# EAGLE schematic remote_2313_4313 (EAGLE 7.6.0)
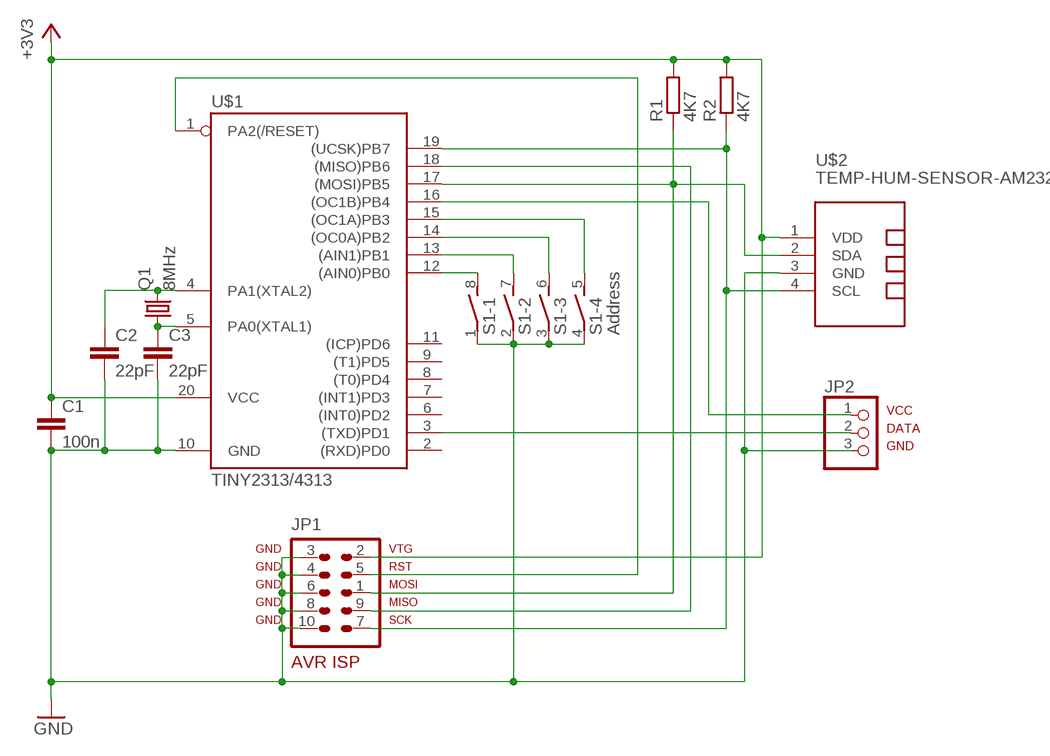
[diagram p0: schematic, sheet 1]

## Parts
C1  100n  C-EU025-025X050  [C025-025X050]
C2  22pF  C-EU025-024X044  [C025-024X044]
C3  22pF  C-EU025-024X044  [C025-024X044]
JP1  AVR-ISP-10  [AVR-ISP-10]
JP2  PINHD-1X3  [1X03]
Q1  8MHz  CRYSTALHC49U-V  [HC49U-V]
R1  4K7  R-EU_0204/5  [0204/5]
R2  4K7  R-EU_0204/5  [0204/5]
S1  Address  DIP04S  [DIP04S]
U$1  TINY2313/4313  TINY2313-*P*  [DIL20]
U$2  TEMP-HUM-SENSOR-AM2322  [TEMP-HUM-SENSOR-AM2322]

## Nets
+3V3: C1.1 JP1.2 R1.2 R2.2 U$1.20(VCC) U$2.1(VDD)
GND: C1.2 C2.2 C3.2 JP1.3 JP1.4 JP1.6 JP1.8 JP1.10 JP2.3 S1.1 S1.2 S1.3 S1.4 U$1.10(GND) U$2.3(GND)
N$1: S1.8 U$1.12((AIN0)PB0)
N$2: S1.7 U$1.13((AIN1)PB1)
N$3: S1.6 U$1.14((OC0A)PB2)
N$4: S1.5 U$1.15((OC1A)PB3)
N$5: JP2.1 U$1.16((OC1B)PB4)
N$6: JP1.1 R1.1 U$1.17((MOSI)PB5) U$2.2(SDA)
N$7: JP2.2 U$1.3((TXD)PD1)
N$8: JP1.7 R2.1 U$1.19((UCSK)PB7) U$2.4(SCL)
N$9: JP1.9 U$1.18((MISO)PB6)
N$10: JP1.5 U$1.1(PA2(/RESET))
N$11: C3.1 Q1.1 U$1.5(PA0(XTAL1))
N$12: C2.1 Q1.2 U$1.4(PA1(XTAL2))
Unconnected: U$1.2((RXD)PD0) U$1.6((INT0)PD2) U$1.7((INT1)PD3) U$1.8((T0)PD4) U$1.9((T1)PD5) U$1.11((ICP)PD6)

## Notes on the sheet
- VCC
  DATA
  GND

## Library data of the parts
C1-C3 = rcl:C-EU: CAPACITOR, European symbol
JP1 = avr-7:AVR-ISP-10: AVR ISP-10 Serial Programming Header
JP2 = pinhead:PINHD-1X3: PIN HEADER
Q1 = crystal:CRYSTAL: CRYSTAL; OC_FARNELL: 1666969; OC_NEWARK: unknown
R1 R2 = rcl:R-EU_: RESISTOR, European symbol
S1 = switch-dil:DIP04S: DIL/CODE SWITCH; OC_FARNELL: unknown; OC_NEWARK: unknown
U$1 = avr-7:TINY2313*: Atmel Tiny2313 2K Flash, 128 bytes EEPROM, 128 bytes RAM
U$2 = diy-modules:TEMP-HUM-SENSOR-AM2322: AM2322 - digital humidity & temperature sensor More information about AM2322 is available here: http://www.electrodragon.com/w/AM2322 Click here to find device on ebay.com <http://www.ebay.com/sch/am2322+digital+sensor>